# Altium schematic sheet Pixel1.0_0.SchDoc: Pixel1.0
size 409 x 282 mm; Date: 5/11/2016 6:59:06 PM; SheetNumber: 1
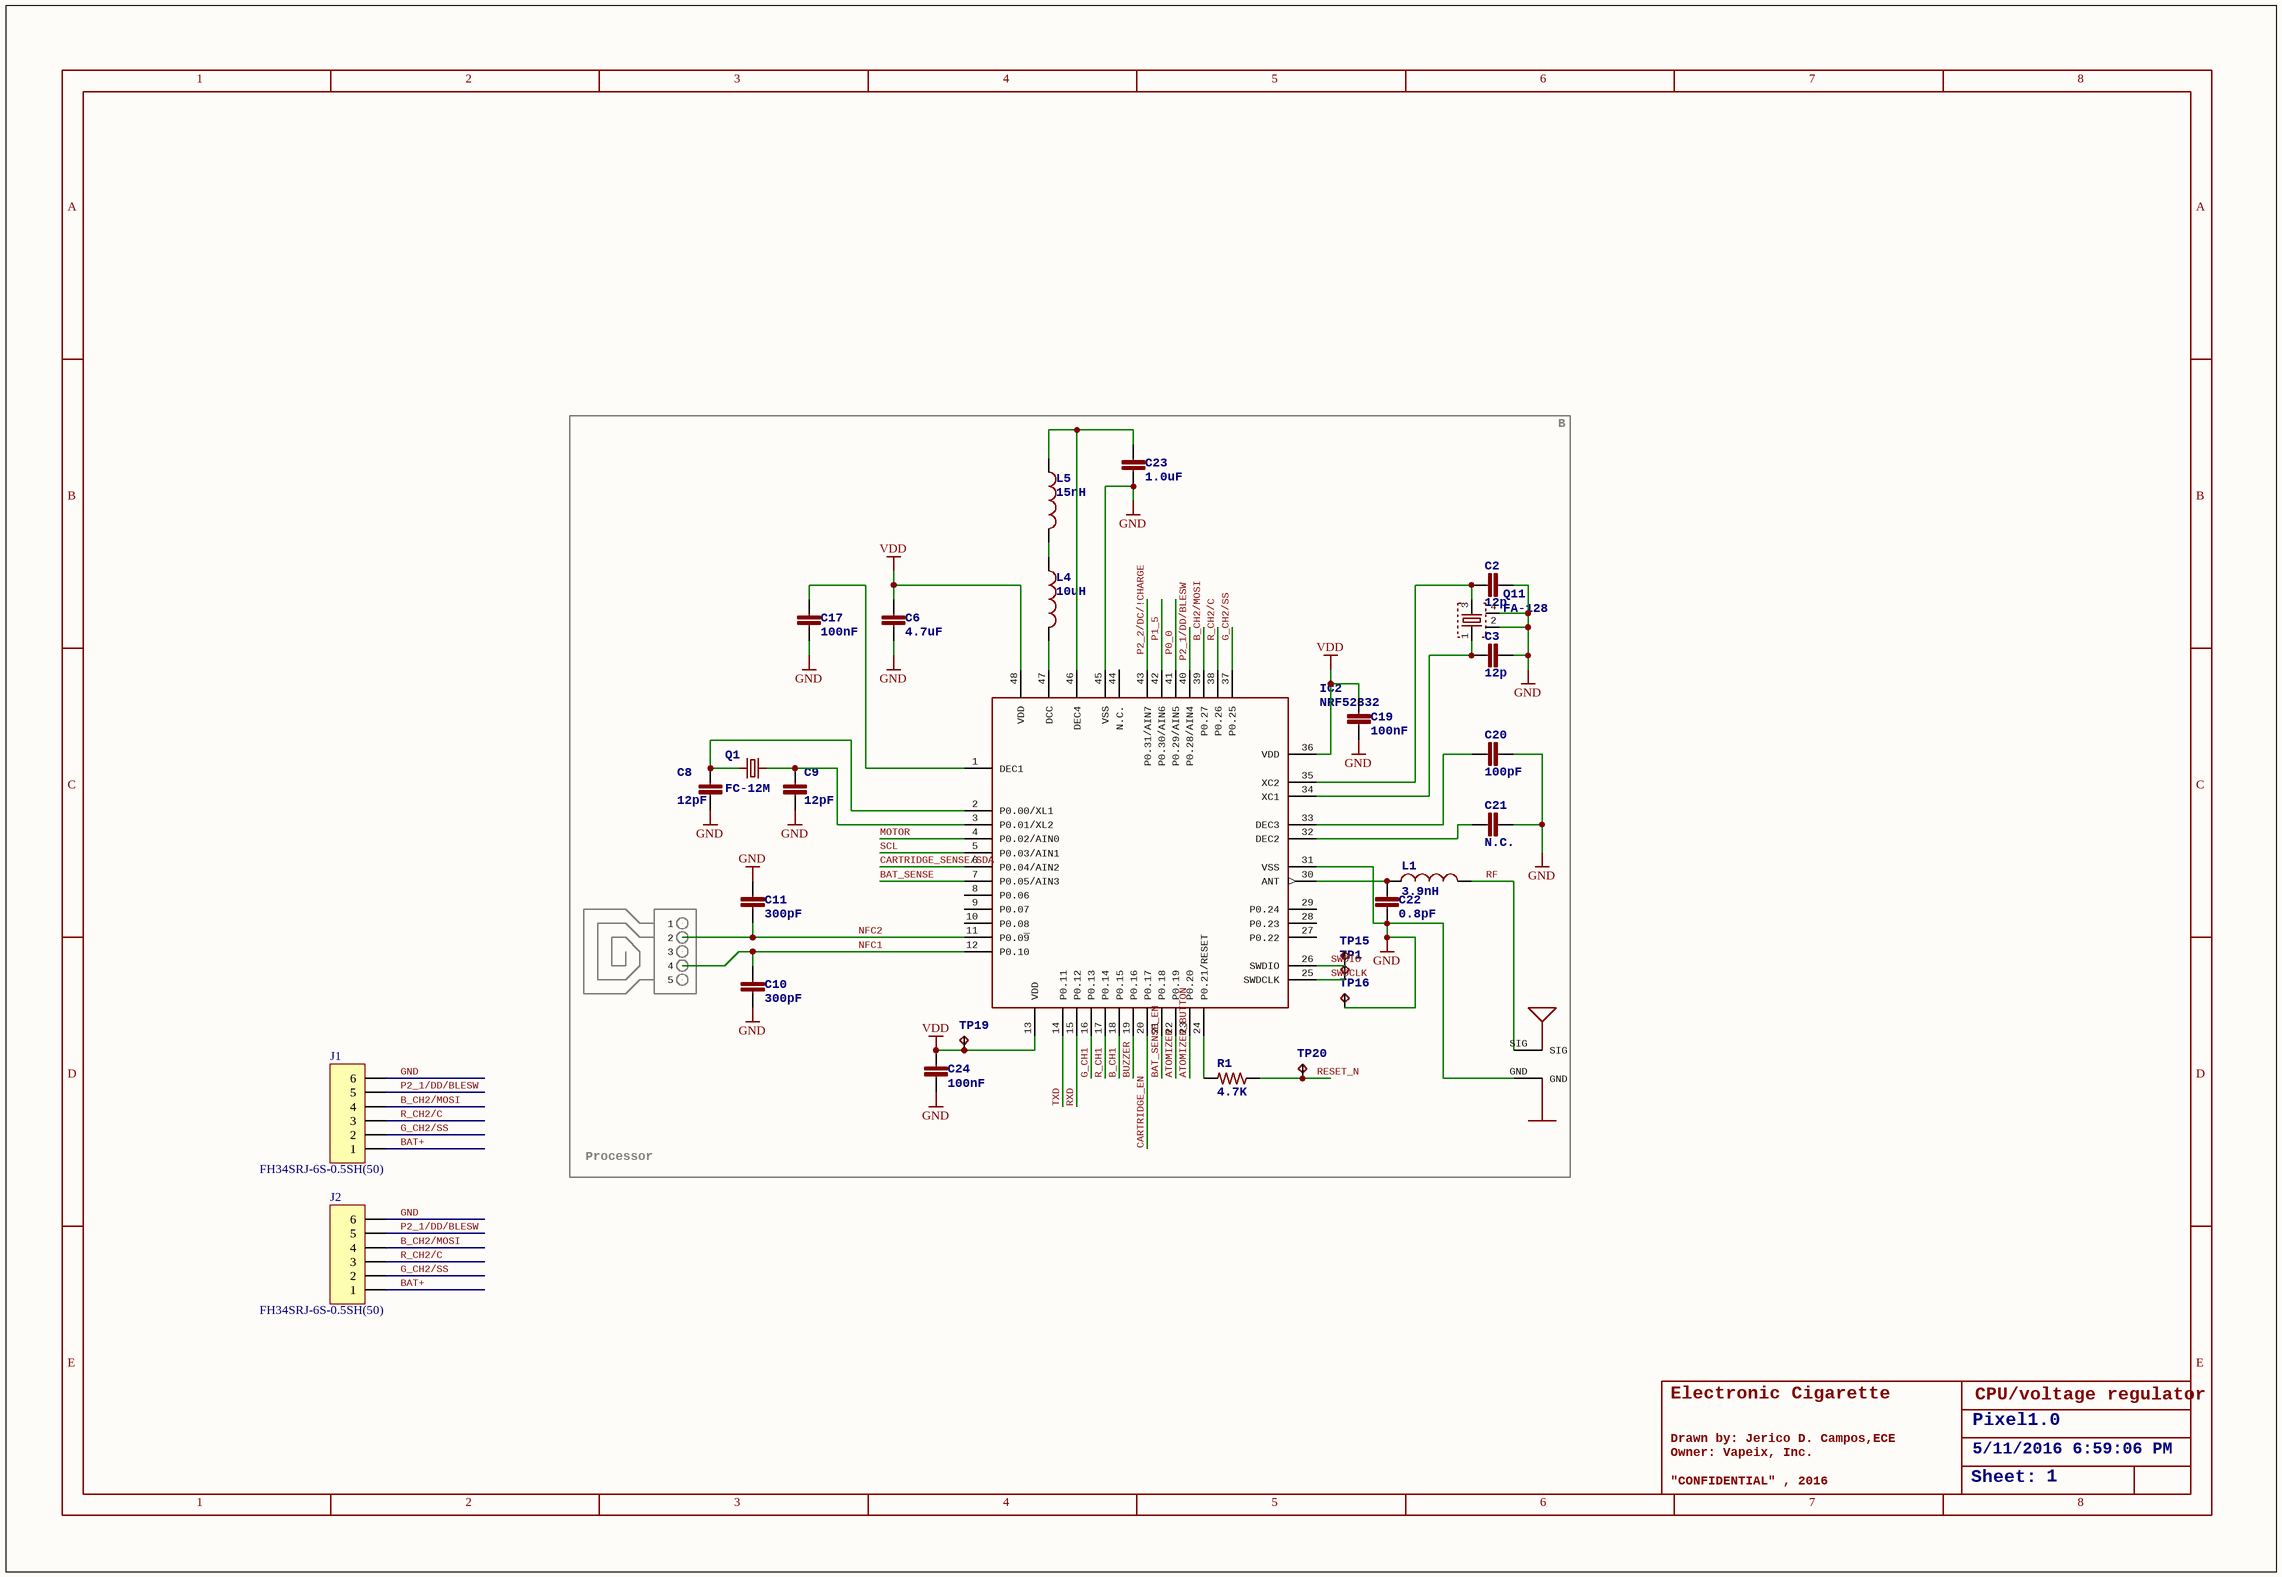
[diagram p0: Pixel1.0_0.SchDoc]

## Parts
ANT  U.FL  [U.FL]  (value not drawn)
C2  12p  [C0201]
C3  12p  [C0201]
C6  4.7uF  [C0201]
C8  12pF  [C0201]
C9  12pF  [C0201]
C10  300pF  [C0201]
C11  300pF  [C0201]
C17  100nF  [C0201]
C19  100nF  [C0201]
C20  100pF  [C0201]
C21  N.C.  [C0201]
C22  0.8pF  [C0201]
C23  1.0uF  [C0201]
C24  100nF  [C0201]
IC2  NRF52832  [QFN-48]
J1  FH34SRJ-6S-0.5SH(50)  [59453061110ECHLF]
J2  FH34SRJ-6S-0.5SH(50)  [59453061110ECHLF]
L1  3.9nH  [JE0402]
L4  10uH  [JE0402]
L5  15nH  [JE0402]
Q1  FC-12M  [FC-12M]
Q11  FA-128  [FA-128]
R1  4.7K  [R0201]
TP1  TPTP06R  [TP06R]  (value not drawn)
TP15  TPTP06R  [TP06R]  (value not drawn)
TP16  TPTP06R  [TP06R]  (value not drawn)
TP19  TPTP06R  [TP06R]  (value not drawn)
TP20  TPTP06R  [TP06R]  (value not drawn)
U$2  NFCCONNECTORMOLEX_5PIN  [NFC.CONN]  (value not drawn)

## Nets
GND: ANT.GND C2.2 C3.1 C6.2 C8.2 C9.2 C10.2 C11.2 C17.2 C19.2 C20.1 C21.1 C22.2 C23.2 C24.2 IC2.31(VSS) IC2.45(VSS) J1.6 J2.6 Q11.2 Q11.4 TP16.TP
VDD: C6.1 C19.1 C24.1 IC2.13(VDD) IC2.36(VDD) IC2.48(VDD) TP19.TP
ATOMIZER: IC2.22(P0.19)
ATOMIZER_BUTTON: IC2.23(P0.20)
B_CH1: IC2.18(P0.15)
B_CH2/MOSI: IC2.39(P0.27) J1.4 J2.4
BAT+: J1.1 J2.1
BAT_SENSE: IC2.7(P0.05/AIN3)
BAT_SENSE_EN: IC2.21(P0.18)
BUZZER: IC2.19(P0.16)
CARTRIDGE_EN: IC2.20(P0.17)
CARTRIDGE_SENSE/SDA: IC2.6(P0.04/AIN2)
G_CH1: IC2.16(P0.13)
G_CH2/SS: IC2.37(P0.25) J1.2 J2.2
MOTOR: IC2.4(P0.02/AIN0)
NFC1: C10.1 IC2.12(P0.10) U$2.4
NFC2: C11.1 IC2.11(P0.0~{9}) U$2.2
P0_0: IC2.41(P0.29/AIN5)
P1_5: IC2.42(P0.30/AIN6)
P2_1/DD/BLESW: IC2.40(P0.28/AIN4) J1.5 J2.5
P2_2/DC/!CHARGE: IC2.43(P0.31/AIN7)
R_CH1: IC2.17(P0.14)
R_CH2/C: IC2.38(P0.26) J1.3 J2.3
RESET_N: R1.1 TP20.TP
RF: ANT.SIG L1.2
RXD: IC2.15(P0.12)
SCL: IC2.5(P0.03/AIN1)
SWDCLK: IC2.25(SWDCLK) TP1.TP
SWDIO: IC2.26(SWDIO) TP15.TP
TXD: IC2.14(P0.11)
NetC2_1: C2.1 IC2.35(XC2) Q11.3
NetC3_2: C3.2 IC2.34(XC1) Q11.1
NetC8_1: C8.1 IC2.2(P0.00/XL1) Q1.1
NetC9_1: C9.1 IC2.3(P0.01/XL2) Q1.2
NetC17_1: C17.1 IC2.1(DEC1)
NetC20_2: C20.2 IC2.33(DEC3)
NetC21_2: C21.2 IC2.32(DEC2)
NetC22_1: C22.1 IC2.30(ANT) L1.1
NetC23_1: C23.1 IC2.46(DEC4) L5.1
NetIC2_24: IC2.24(P0.21/RESET) R1.2
NetIC2_47: IC2.47(DCC) L4.2
NetL4_1: L4.1 L5.2

Not connected (* = marked no-connect by the designer): IC2 8(P0.06) 9(P0.07) 10(P0.08) 27(P0.22) 28(P0.23) 29(P0.24) 44(N.C.); U$2 1 3 5

## Notes on the sheet
- B
- Processor
- Electronic Cigarette
- Drawn by: Jerico D. Campos,ECE
- Owner: Vapeix, Inc.
- Pixel1.0
- 5/11/2016 6:59:06 PM
- CPU/voltage regulator
- "CONFIDENTIAL" , 2016
- Sheet:
- 1
- 2
- 3
- 4
- 5
- 6
- 7
- 8
- A
- C
- D
- E

## Library data of the parts
C2 C3 C6 C8-C11 C17 C19-C24 = C-EUC0201: CAPACITOR, European symbol
J1 J2 = WE-ZIF Connector WR-FPC 68710614522: WR-FPC 0.50mm SMT ZIF Horizontal Bottom Contact; Manufacturer: W¨¹rth Elektronik eiSos GmbH; ComponentLink1 Description: Manufacturer; ComponentLink2 Description: Datasheet; NoPins: 06; Created Date: 28 October 2013; partNo: 68710614522; ComponentLink1URL: http://www.we-online.com; ComponentLink2URL: http://katalog.we-online.de/em/datasheet/6871xx14522.pdf; Created by: Karrer Zheng
L1 L4 L5 = LBEAD
Q1 = FC-12M: kHz RANGE CRYSTAL UNIT   LOW PROFILE SMDSource: Epson Toyocom FC-12M.pdf
Q11 = FA-128: MHz RANGE CRYSTAL UNIT    Source: Epson Toyocom
R1 = R-US_R0201: RESISTOR, American symbol
TP1 TP15 TP16 TP19 TP20 = TPTP06R: Test pad